# EAGLE design Proximity Sensor (EAGLE 7.7.0)
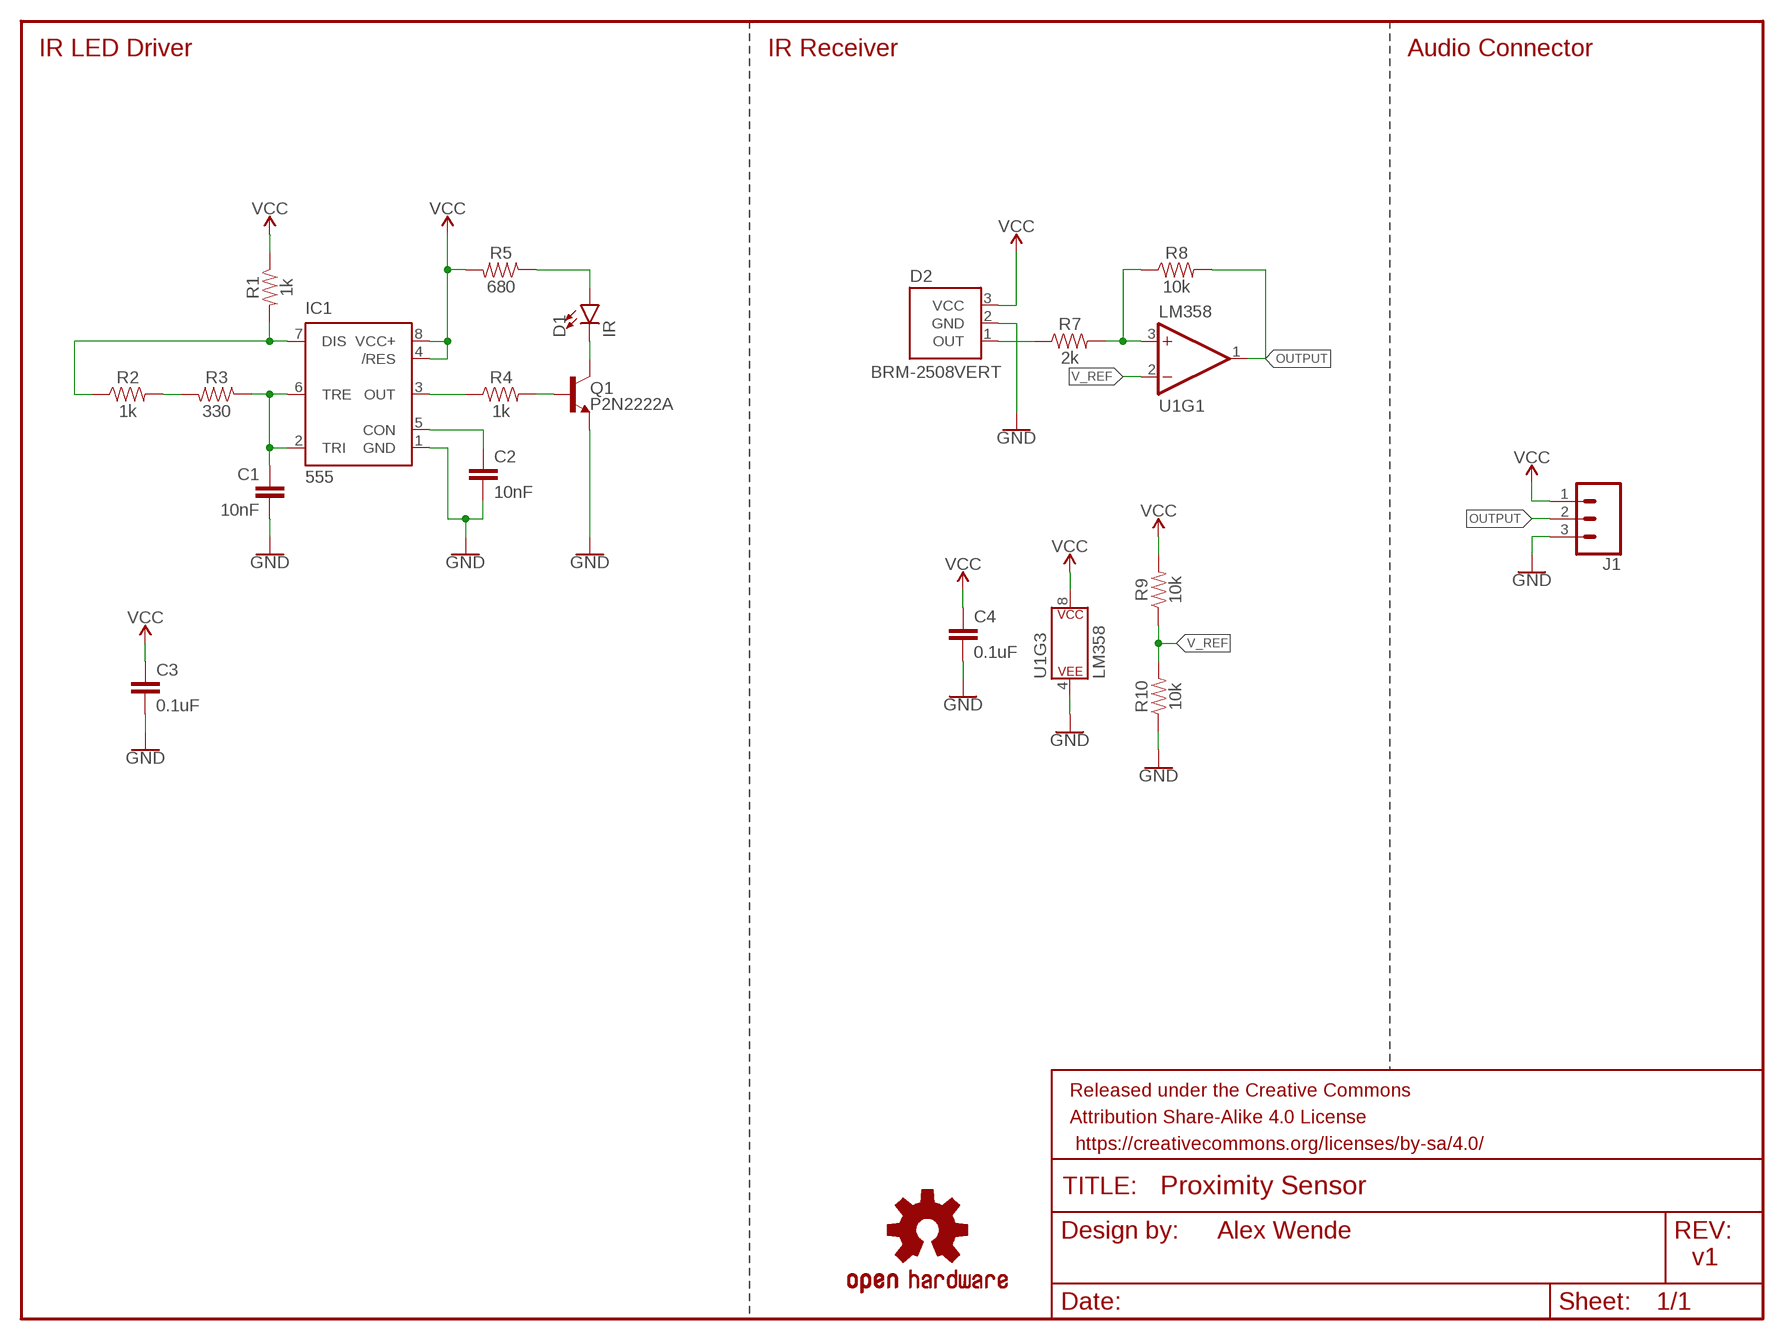
[diagram p0: schematic, sheet 1]

## Parts
C1  10nF  10NF-PTH-10MM-10000V-1-%  [CAP-PTH-10MM]
C2  10nF  10NF-PTH-10MM-10000V-1-%  [CAP-PTH-10MM]
C3  0.1uF  0.1UF-KIT-EZ-50V-20%  [CAP-PTH-SMALL-KIT]
C4  0.1uF  0.1UF-KIT-EZ-50V-20%  [CAP-PTH-SMALL-KIT]
D1  IR  LED5MM-KIT  [LED_5MM-KIT]
D2  BRM-2508VERT  [BRM-2508_VERT]
FRAME1  FRAME-LETTERNO_PACKAGE  [DUMMY]
IC1  555  555KIT  [DIP08-KIT]
J1  CONN_03LONGPADS  [1X03_LONGPADS]
LOGO1  OSHW-LOGOM  [OSHW-LOGO-M]
Q1  P2N2222A  TRANS_NPN-P2N2222A  [TO-92]
R1  1k  1KOHM-HORIZ_KIT-1/4W-1%  [AXIAL-0.3-KIT]
R2  1k  1KOHM-HORIZ_KIT-1/4W-1%  [AXIAL-0.3-KIT]
R3  330  1KOHM-HORIZ_KIT-1/4W-1%  [AXIAL-0.3-KIT]
R4  1k  1KOHM-HORIZ_KIT-1/4W-1%  [AXIAL-0.3-KIT]
R5  680  1KOHM-HORIZ_KIT-1/4W-1%  [AXIAL-0.3-KIT]
R7  2k  1KOHM-HORIZ_KIT-1/4W-1%  [AXIAL-0.3-KIT]
R8  10k  1KOHM-HORIZ_KIT-1/4W-1%  [AXIAL-0.3-KIT]
R9  10k  1KOHM-HORIZ_KIT-1/4W-1%  [AXIAL-0.3-KIT]
R10  10k  1KOHM-HORIZ_KIT-1/4W-1%  [AXIAL-0.3-KIT]
U1  LM358  LM358KIT  [DIP08-KIT]

## Nets
GND: C1.2 C2.2 C3.2 C4.2 D2.2(GND) IC1.1(GND) J1.3 Q1.3(E) R10.P$1 U1.4(P$V-)
N$1: C1.1 IC1.2(TRI) IC1.6(TRE) R3.P$1
N$2: IC1.7(DIS) R1.P$2 R2.P$1
N$3: C2.1 IC1.5(CON)
N$4: R2.P$2 R3.P$2
N$5: Q1.2(B) R4.P$2
N$6: IC1.3(OUT) R4.P$1
N$7: D1.A R5.P$1
N$8: D1.K(C) Q1.1(C)
N$9: R7.P$2 R8.P$1 U1.3(+IN)
N$10: D2.1(OUT) R7.P$1
OUTPUT: J1.2 R8.P$2 U1.1(OUT)
V_REF: R9.P$1 R10.P$2 U1.2(-IN)
VCC: C3.1 C4.1 D2.3(VCC) IC1.4(/RES) IC1.8(VCC+) J1.1 R1.P$1 R5.P$2 R9.P$2 U1.8(P$V+)
Unconnected: U1.5(+IN) U1.6(-IN) U1.7(OUT)

## Notes on the sheet
- IR LED Driver | IR Receiver | Audio Connector
- Alex Wende
- v1

## Library data of the parts
C1 C2 = SparkFun-Capacitors:10NF: 0.01uF/10nF/10,000pF ceramic capacitors A capacitor is a passive two-terminal electrical component used to store electrical energy temporarily in an electric field. CAP-09321; PROD_ID: CAP-09321
C3 C4 = SparkFun-Capacitors:0.1UF: 0.1µF ceramic capacitors A capacitor is a passive two-terminal electrical component used to store electrical energy temporarily in an electric field.; PROD_ID: CAP-08370
D1 = SparkFun-LED:LED: LED (Generic) Standard schematic elements and footprints for 5mm, 3mm, 1206, and 0603 sized LEDs. Generic LEDs with no color specified.
D2 = SparkFun-Sensors:BRM-2508: BRM-2508 IR Receiver Module 2.7V/5.5V IR Receiver with Low Power Consumption, High-immunity Against Ambient Light. Example Datasheet <http://www.sinoskysun.com/upload/20110512/201105120447164615.PDF>; PROD_ID: COMP-12059
FRAME1 = SparkFun-Aesthetics:FRAME-LETTER: Schematic Frame - Letter Standard 8.5x11 US Letter frame; DESIGNER: Nobody; VERSION: v01
IC1 = SparkFun-IC-Special-Function:555: General purpose bipolar Timer Datasheet <http://www.sparkfun.com/datasheets/Components/General/ne555.pdf> SparkFun Products SparkFun SparkPunk Sequencer Kit <https://www.sparkfun.com/products/12707> (KIT-12707) Storefront Component: 555 Timer <https://www.sparkfun.com/products/9273> (COM-09273) Two parts valid for production: VFP: IC-11930 (M7555 PTH) VFP: IC-09173 (555 PTH) - Preferred; PROD_ID: IC-09173; PROD_ID_ALT: IC-11930
J1 = SparkFun-Connectors:CONN_03: Multi connection point. Often used as Generic Header-pin footprint for 0.1 inch spaced/style header connections On any of the 0.1 inch spaced packages, you can populate with these: Break Away Headers - Straight <https://www.sparkfun.com/products/116> (PRT-00116) Break Away Male Headers - Right Angle <https://www.sparkfun.com/products/553> (PRT-00553) Female Headers <https://www.sparkfun.com/products/115> (PRT-00115) Break Away Headers - Machine Pin <https://www.sparkfun.com/products/117> (PRT-00117) Break Away Female Headers - Swiss Machine Pin <https://www.sparkfun.com/products/743> (PRT-00743) Stackable Header - 3 Pin (Female, 0.1") <https://www.sparkfun.com/products/13875> (PRT-13875) For SCREWTERMINALS and SPRING TERMINALS visit here: Screw Terimnals on SparkFun.com <https://www.sparkfun.com/search/results?term=Screw+Terminals> (5mm/3.5mm/2.54mm spacing) This device is also useful as a general connection point to wire up your design to another part of your project. Our various solder wires solder well into these plated through hole pads. Hook-Up Wire - Assortment (Stranded, 22 AWG) <https://www.sparkfun.com/products/11375> (PRT-11375) Hook-Up Wire - Assortment (Solid Core, 22 AWG) <https://www.sparkfun.com/products/11367> (PRT-11367) View the entire wire category on our website here <https://www.sparkfun.com/categories/141> Special notes: Molex polarized connector foot print use with SKU : PRT-08232 with associated crimp pins and housings.
LOGO1 = SparkFun-Aesthetics:OSHW-LOGO: Open-Source Hardware (OSHW) Logo This logo indicates the piece of hardware it is found on incorporates a OSHW license and/or adheres to the definition of open source hardware found here: http://freedomdefined.org/OSHW
Q1 = SparkFun-DiscreteSemi:TRANS_NPN: NPN transistor Current controlled devices typically used to amplify current or used as a switch. BC547 - COM-08928 <http://www.sparkfun.com/products/8928> (TO-92 45V 100mA) (1.Collector 2.Base 3.Emitter) 2N3904 - COM-00521 <http://www.sparkfun.com/products/521> (TO-92 40V 200mA) (1.Emitter 2.Base 3.Collector) P2N2222A - COM-12852 <http://www.sparkfun.com/products/12852> (TO-92 40V 600mA) (1.Collector 2.Base 3.Emitter); PROD_ID: TRANS-09536; VALUE: 600mA/40V
R1 R2 R4 = SparkFun-Resistors:1KOHM: 1kΩ resistor A resistor is a passive two-terminal electrical component that implements electrical resistance as a circuit element. Resistors act to reduce current flow, and, at the same time, act to lower voltage levels within circuits. - Wikipedia; PROD_ID: RES-12182
R3 R5 R7-R10 = SparkFun-Resistors:1KOHM: 1kΩ resistor A resistor is a passive two-terminal electrical component that implements electrical resistance as a circuit element. Resistors act to reduce current flow, and, at the same time, act to lower voltage levels within circuits. - Wikipedia; PROD_ID: RES-12182; VALUE: 1k
U1 = SparkFun-IC-Amplifiers:LM358: LM358 Jellybean op-amp Datasheet <http://www.sparkfun.com/datasheets/Components/General/LM358.pdf> SparkFun Products Op-Amp (Thru-Hole) - LM358 <https://www.sparkfun.com/products/9456> (COM-09456); PROD_ID: IC-09172

## Board
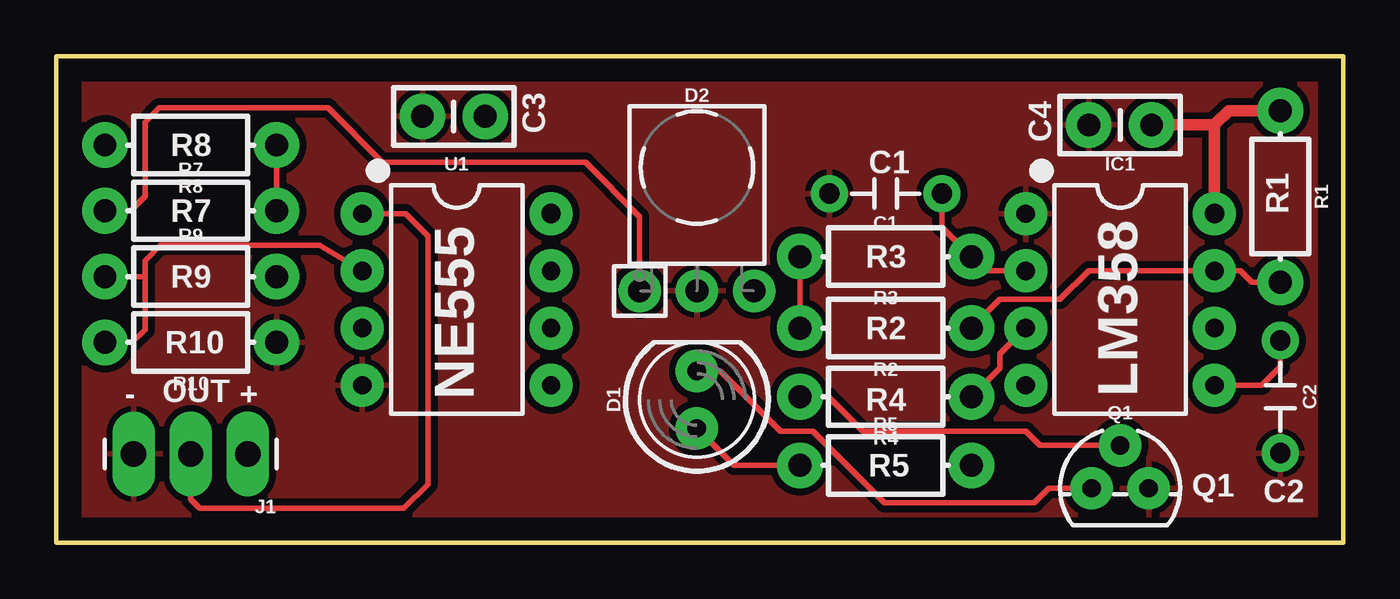
[diagram p1: board, top side]
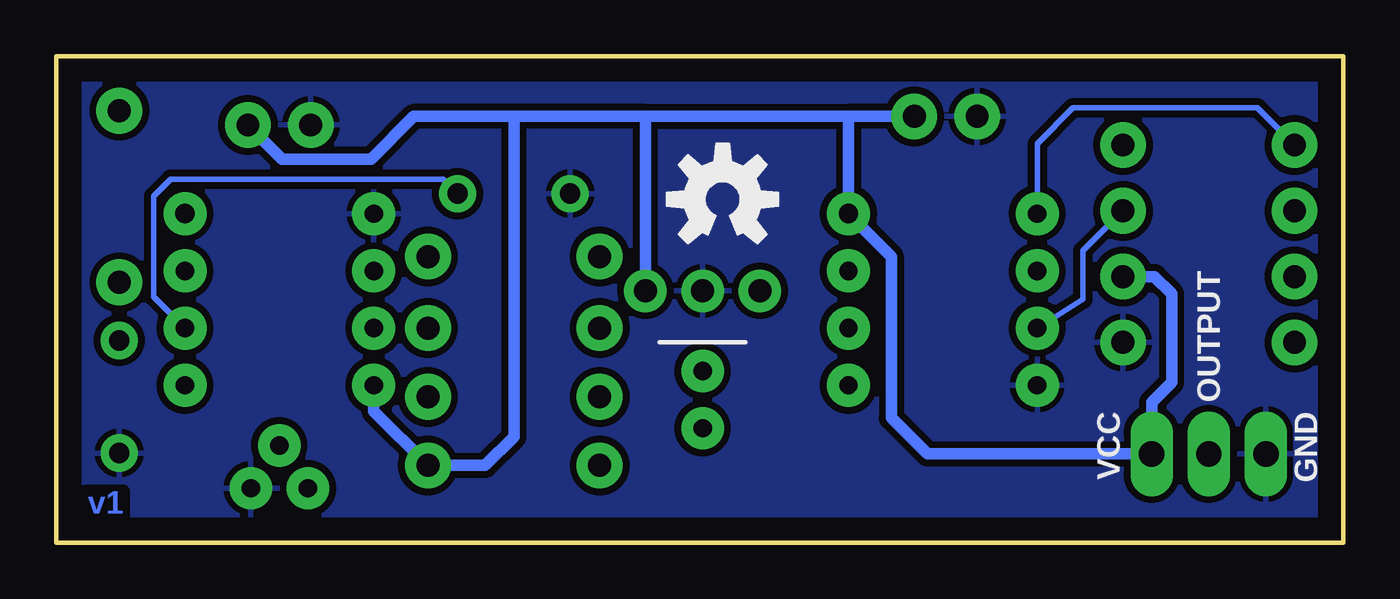
[diagram p2: board, bottom side, seen from below]

Size 57.15 x 21.59 mm. Coordinates in mm from the lower left corner, seen from the top.
Outline: 0,0 57.15,0 57.15,21.59 0,21.59 0,0
Copper layers (1*16): Top 0.035mm / dielectric 1.5mm / Bottom 0.035mm
Design rules "default": minimum track width 10mil, minimum drill 0.6mm, track to track 8mil, track to pad 8mil, pad to pad 8mil, via to via 8mil, smd to smd 8mil, copper to edge 40mil, drill to drill 8mil, minimum pad ring 10mil, minimum via ring 8mil, stop-mask expansion 4mil, vias tented up to drill 0mil, thermal gap 10mil

### Footprints (pad centres in the part's own frame; a part is rotated, then mirrored left to right if it is on the bottom)
CAP-PTH-10MM = drill 0.9 pad 1.651: 1 -2.5,0; 2 2.5,0
CAP-PTH-SMALL-KIT = drill 1.016 pad 2.032: 1 -1.397,0; 2 1.397,0
LED_5MM-KIT = drill 0.813 pad 1.88: A -1.27,0; K 1.27,0
BRM-2508_VERT = drill 1.016 pad 1.88: 1 -2.54,0; 2 0,0; 3 2.54,0
DIP08-KIT = drill 0.813 pad 1.905: 1 -3.81,-4.191; 2 -1.27,-4.191; 3 1.27,-4.191; 4 3.81,-4.191; 5 3.81,4.191; 6 1.27,4.191; 7 -1.27,4.191 | drill 0.864 pad 1.905: 8 -3.81,4.191
1X03_LONGPADS = drill 1.118 pad 1.88 long: 1 0,0; 2 2.54,0; 3 5.08,0
TO-92 = drill 0.813 pad 1.88: 1 -1.27,0; 2 0,1.905; 3 1.27,0
AXIAL-0.3-KIT = drill 1.016 pad 2.032: P$1 -3.81,0; P$2 3.81,0

### Placement (x,y rotation side)
C1  36.83,15.49 180 top
C2  54.36,6.48 270 top
C3  17.65,18.92 180 top
C4  47.24,18.54 180 top
D1  28.45,6.35 90 top
D2  28.45,11.18 0 top
FRAME1  6.35,-2.54 0 top
IC1  47.24,10.79 270 top
J1  8.51,3.94 180 top
LOGO1  27.56,15.24 0 bottom
Q1  47.24,2.41 0 top
R1  54.36,15.37 270 top
R2  36.83,9.53 180 top
R3  36.83,12.7 180 top
R4  36.83,6.48 180 top
R5  36.83,3.43 0 top
R7  5.97,14.73 0 top
R8  5.97,17.65 180 top
R9  5.97,11.81 0 top
R10  5.97,8.89 180 top
U1  17.78,10.79 270 top

### Tracks (layer width: path | path; a pad name or v marks a point on that pad's centre or on a via)
GND
  pour Bottom (isolate 0.305): 0,21.59 57.15,21.59 57.15,0 0,0
  pour Top (isolate 0.305): 0,21.59 57.15,21.59 57.15,0 0,0
N$1
  Top 0.254: IC1.2 41.27,12.06 R3.P$1 39.33,14.01 C1.1
  Bottom 0.254: IC1.6 52.83,10.92 52.83,15.37 52.07,16.13 39.97,16.13 C1.1
N$2
  Top 0.254: R1.P$2 53.09,11.56 52.58,12.06 IC1.7 45.85,12.06 44.58,10.79 41.91,10.79 R2.P$1
N$3
  Top 0.254: C2.1 54.36,7.8 53.54,6.99 IC1.5
N$4
  Top 0.254: R3.P$2 R2.P$2
N$5
  Top 0.254: Q1.2 43.69,4.32 43.05,4.95 35.81,4.95 34.29,6.48 R4.P$2
N$6
  Top 0.254: R4.P$1 41.91,7.75 41.91,8.38 IC1.3
N$7
  Top 0.254: R5.P$1 30.1,3.43 D1.A
N$8
  Top 0.254: Q1.1 44.07,2.41 43.43,1.78 36.77,1.78 33.6,4.95 32.16,4.95 29.5,7.62 D1.K
N$9
  Top 0.254: R8.P$1 R7.P$2
  Bottom 0.254: R7.P$2 11.56,12.95 11.56,10.79 U1.3
N$10
  Top 0.254: D2.1 25.91,14.48 23.5,16.89 14.48,16.89 12.06,19.3 4.57,19.3 3.94,18.67 3.94,15.37 3.3,14.73 R7.P$1
OUTPUT
  Top 0.254: J1.2 5.97,1.93 6.37,1.52 15.43,1.52 16.51,2.6 16.51,13.61 15.52,14.61 U1.1
  Bottom 0.254: R8.P$2 3.81,19.3 12,19.3 13.59,17.71 U1.1
V_REF
  Top 0.254: U1.2 11.68,13.21 4.62,13.21 3.94,12.52 3.94,11.81 | 3.94,11.81 R9.P$1 | R10.P$2 3.37,8.89 3.94,9.46 3.94,11.81
VCC
  Top 0.508: C4.1 51.44,18.54 | 51.44,18.54 IC1.8 | R1.P$1 52.07,19.18 51.44,18.54
  Bottom 0.508: IC1.4 43.05,5.84 R5.P$2 38.1,3.43 36.83,4.7 36.83,18.92 | C3.1 21.97,18.92 | 21.97,18.92 U1.8 20.07,12.7 20.07,5.54 18.46,3.94 J1.1 8.51,6.22 7.62,7.11 7.62,11.05 8.38,11.81 R9.P$2 | D2.3 30.99,18.92 | 30.99,18.92 21.97,18.92 | C4.1 47.12,17.02 43.18,17.02 41.27,18.92 36.83,18.92 | 30.99,18.92 36.83,18.92

### Text on the board
Bottom: v1
tPlace: C3 | C4 | R8 | C1 | R1 | R7 | R3 | R9 | R2 | R10 | - | OUT | + | NE555 | R4 | LM358 | R5 | Q1 | C2
bPlace: OUTPUT | GND | VCC